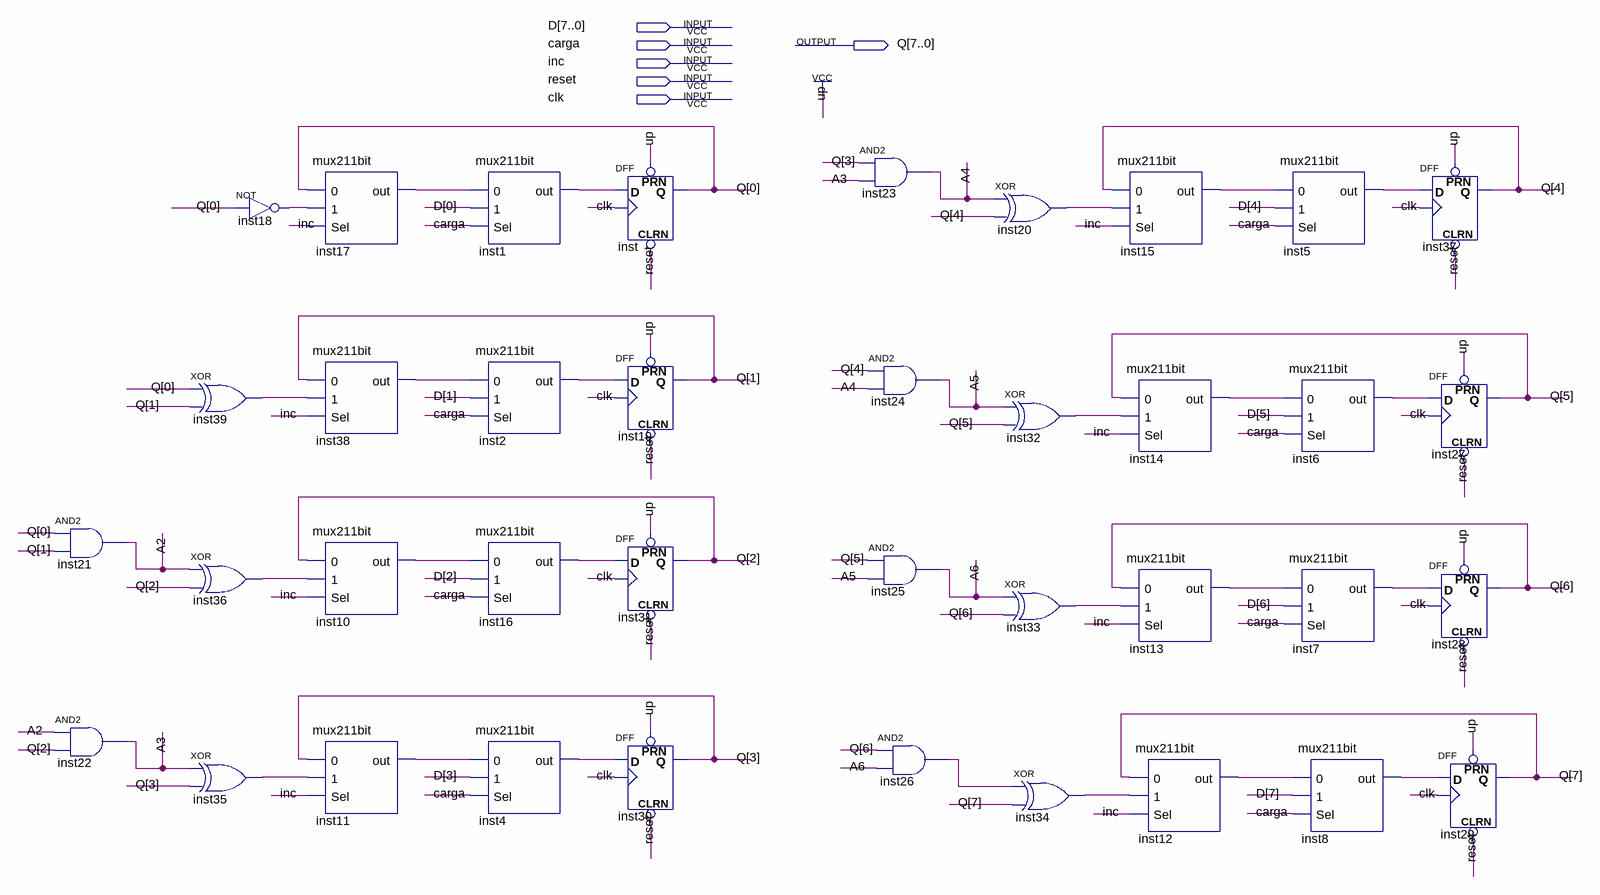
[diagram p0: schematic sheet]
// Quartus schematic PC.bdf as structural Verilog: 38 symbols, 6 pins
module PC (
  input  [7:0] D,
  input  carga,
  input  inc,
  input  reset,
  input  clk,
  output [7:0] Q
);

  wire A2, A3, A4, A5, A6, inst1_out, inst2_out, inst4_out, inst5_out, inst6_out, inst7_out, inst8_out,
       inst10_out, inst11_out, inst12_out, inst13_out, inst14_out, inst15_out, inst16_out, inst17_out,
       inst18_out, inst20_out, inst26_out, inst32_out, inst33_out, inst34_out, inst35_out, inst36_out,
       inst38_out, inst39_out;

  and inst21 (A2, Q[0], Q[1]);
  and inst22 (A3, A2, Q[2]);
  not inst18 (inst18_out, Q[0]);
  xor inst39 (inst39_out, Q[0], Q[1]);
  xor inst36 (inst36_out, A2, Q[2]);
  xor inst35 (inst35_out, A3, Q[3]);
  mux211bit inst17 (.\0 (Q[0]), .\1 (inst18_out), .Sel(inc), .out(inst17_out));
  mux211bit inst38 (.\0 (Q[1]), .\1 (inst39_out), .Sel(inc), .out(inst38_out));
  mux211bit inst10 (.\0 (Q[2]), .\1 (inst36_out), .Sel(inc), .out(inst10_out));
  mux211bit inst11 (.\0 (Q[3]), .\1 (inst35_out), .Sel(inc), .out(inst11_out));
  mux211bit inst1 (.\0 (inst17_out), .\1 (D[0]), .Sel(carga), .out(inst1_out));
  mux211bit inst2 (.\0 (inst38_out), .\1 (D[1]), .Sel(carga), .out(inst2_out));
  mux211bit inst16 (.\0 (inst10_out), .\1 (D[2]), .Sel(carga), .out(inst16_out));
  mux211bit inst4 (.\0 (inst11_out), .\1 (D[3]), .Sel(carga), .out(inst4_out));
  DFF inst (.CLRN(reset), .CLK(clk), .D(inst1_out), .PRN(1'b1), .Q(Q[0]));
  DFF inst19 (.CLRN(reset), .CLK(clk), .D(inst2_out), .PRN(1'b1), .Q(Q[1]));
  DFF inst31 (.CLRN(reset), .CLK(clk), .D(inst16_out), .PRN(1'b1), .Q(Q[2]));
  DFF inst30 (.CLRN(reset), .CLK(clk), .D(inst4_out), .PRN(1'b1), .Q(Q[3]));
  and inst23 (A4, Q[3], A3);
  and inst24 (A5, Q[4], A4);
  and inst25 (A6, Q[5], A5);
  and inst26 (inst26_out, Q[6], A6);
  xor inst20 (inst20_out, A4, Q[4]);
  xor inst32 (inst32_out, A5, Q[5]);
  xor inst33 (inst33_out, A6, Q[6]);
  xor inst34 (inst34_out, inst26_out, Q[7]);
  mux211bit inst15 (.\0 (Q[4]), .\1 (inst20_out), .Sel(inc), .out(inst15_out));
  mux211bit inst14 (.\0 (Q[5]), .\1 (inst32_out), .Sel(inc), .out(inst14_out));
  mux211bit inst13 (.\0 (Q[6]), .\1 (inst33_out), .Sel(inc), .out(inst13_out));
  mux211bit inst12 (.\0 (Q[7]), .\1 (inst34_out), .Sel(inc), .out(inst12_out));
  mux211bit inst5 (.\0 (inst15_out), .\1 (D[4]), .Sel(carga), .out(inst5_out));
  mux211bit inst6 (.\0 (inst14_out), .\1 (D[5]), .Sel(carga), .out(inst6_out));
  mux211bit inst7 (.\0 (inst13_out), .\1 (D[6]), .Sel(carga), .out(inst7_out));
  mux211bit inst8 (.\0 (inst12_out), .\1 (D[7]), .Sel(carga), .out(inst8_out));
  DFF inst37 (.CLRN(reset), .CLK(clk), .D(inst5_out), .PRN(1'b1), .Q(Q[4]));
  DFF inst27 (.CLRN(reset), .CLK(clk), .D(inst6_out), .PRN(1'b1), .Q(Q[5]));
  DFF inst28 (.CLRN(reset), .CLK(clk), .D(inst7_out), .PRN(1'b1), .Q(Q[6]));
  DFF inst29 (.CLRN(reset), .CLK(clk), .D(inst8_out), .PRN(1'b1), .Q(Q[7]));
endmodule
